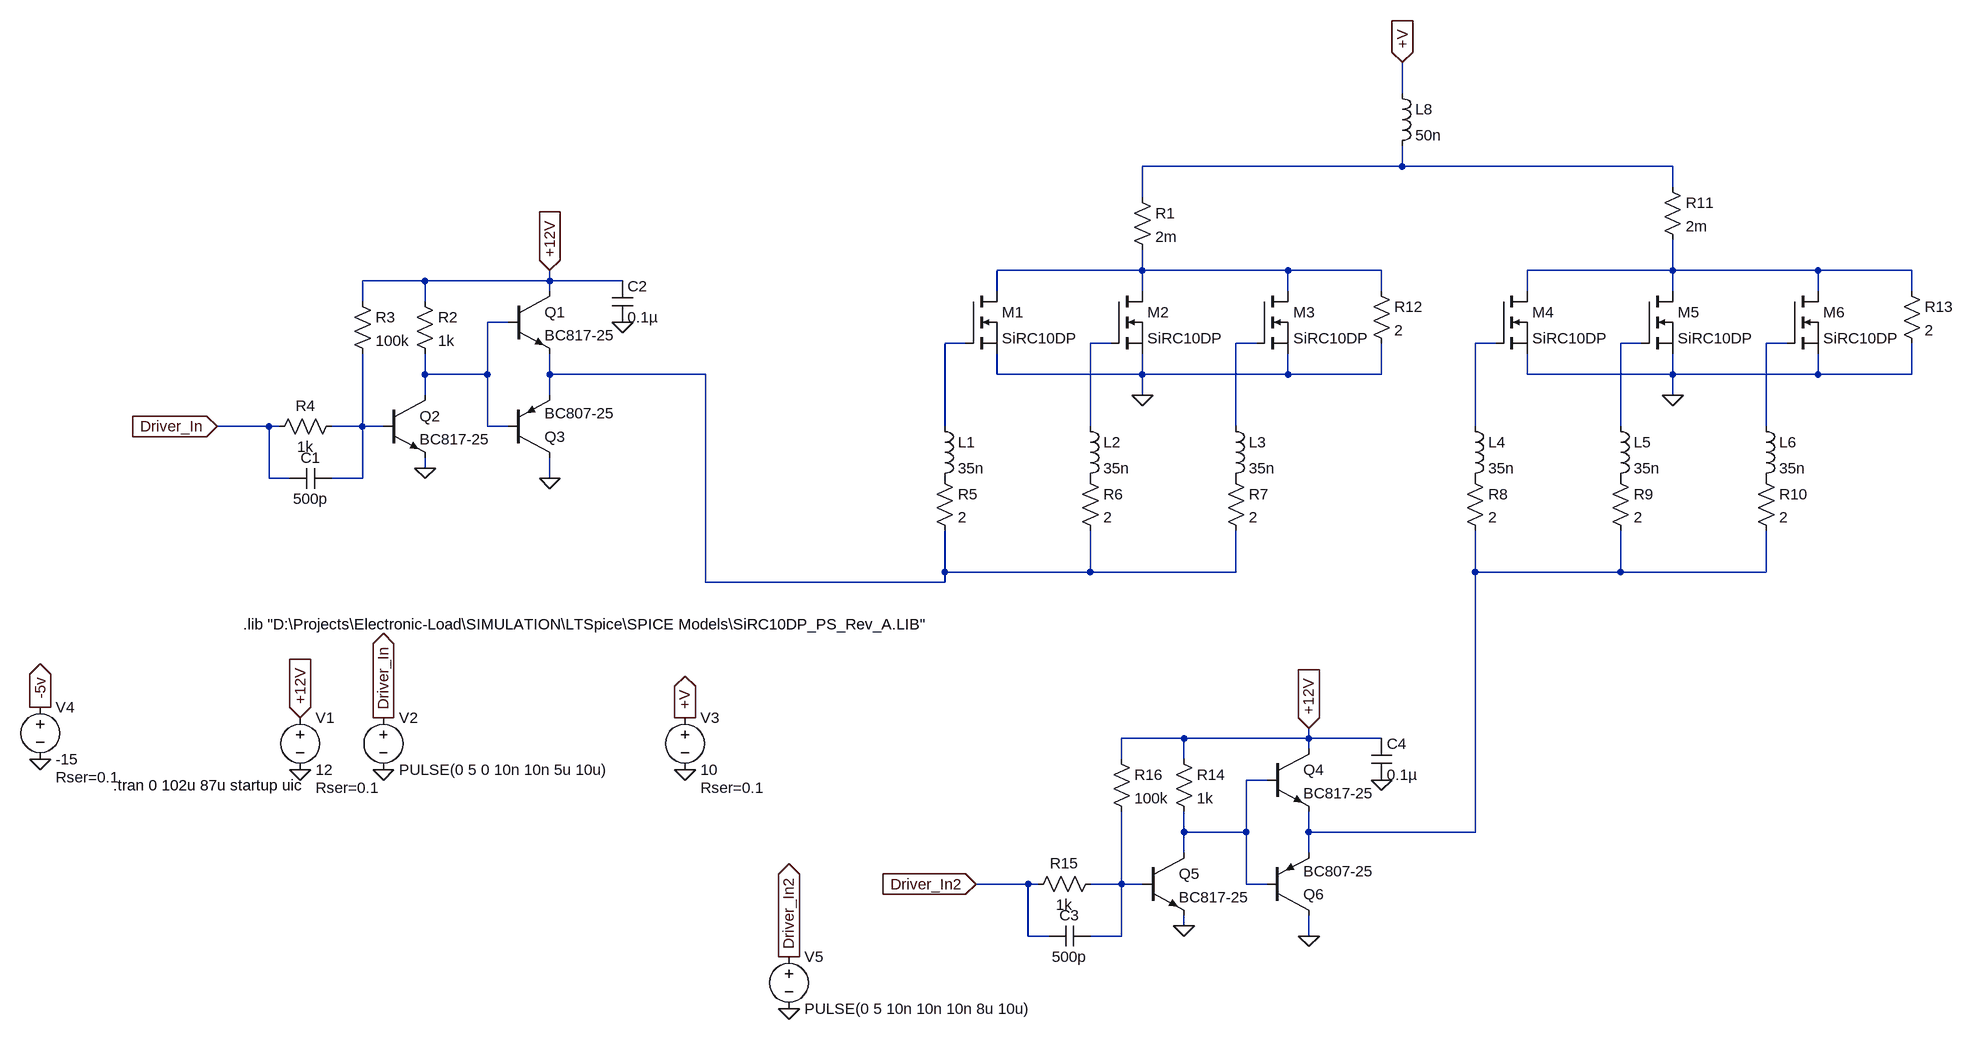
[diagram p0: schematic Gate driver.asc]
Gate driver.asc, the LTspice schematic file:
Version 4
SHEET 1 2420 948
WIRE 1568 -480 1568 -528
WIRE 1568 -368 1568 -400
WIRE 1568 -368 1168 -368
WIRE 1984 -368 1568 -368
WIRE 1984 -336 1984 -368
WIRE 1168 -320 1168 -368
WIRE 1168 -208 1168 -240
WIRE 1168 -208 944 -208
WIRE 1392 -208 1168 -208
WIRE 1536 -208 1392 -208
WIRE 1984 -208 1984 -256
WIRE 1984 -208 1760 -208
WIRE 2208 -208 1984 -208
WIRE 2352 -208 2208 -208
WIRE 64 -192 -32 -192
WIRE 256 -192 256 -208
WIRE 256 -192 64 -192
WIRE 368 -192 256 -192
WIRE 256 -176 256 -192
WIRE 944 -176 944 -208
WIRE 1168 -176 1168 -208
WIRE 1392 -176 1392 -208
WIRE 1536 -176 1536 -208
WIRE 1760 -176 1760 -208
WIRE 1984 -176 1984 -208
WIRE 2208 -176 2208 -208
WIRE 2352 -176 2352 -208
WIRE -32 -160 -32 -192
WIRE 64 -160 64 -192
WIRE 192 -128 160 -128
WIRE 896 -96 864 -96
WIRE 1120 -96 1088 -96
WIRE 1344 -96 1312 -96
WIRE 1712 -96 1680 -96
WIRE 1936 -96 1904 -96
WIRE 2160 -96 2128 -96
WIRE 64 -48 64 -80
WIRE 160 -48 160 -128
WIRE 160 -48 64 -48
WIRE 256 -48 256 -80
WIRE 496 -48 256 -48
WIRE 944 -48 944 -80
WIRE 1168 -48 1168 -80
WIRE 1168 -48 944 -48
WIRE 1392 -48 1392 -80
WIRE 1392 -48 1168 -48
WIRE 1536 -48 1536 -96
WIRE 1536 -48 1392 -48
WIRE 1760 -48 1760 -80
WIRE 1984 -48 1984 -80
WIRE 1984 -48 1760 -48
WIRE 2208 -48 2208 -80
WIRE 2208 -48 1984 -48
WIRE 2352 -48 2352 -96
WIRE 2352 -48 2208 -48
WIRE 64 -16 64 -48
WIRE 256 -16 256 -48
WIRE 1168 -16 1168 -48
WIRE 1984 -16 1984 -48
WIRE -176 32 -256 32
WIRE -160 32 -176 32
WIRE -32 32 -32 -80
WIRE -32 32 -80 32
WIRE 0 32 -32 32
WIRE 160 32 160 -48
WIRE 192 32 160 32
WIRE 864 32 864 -96
WIRE 1088 32 1088 -96
WIRE 1312 32 1312 -96
WIRE 1680 32 1680 -96
WIRE 1904 32 1904 -96
WIRE 2128 32 2128 -96
WIRE 64 96 64 80
WIRE -176 112 -176 32
WIRE -144 112 -176 112
WIRE -32 112 -32 32
WIRE -32 112 -80 112
WIRE 256 112 256 80
WIRE 864 256 864 192
WIRE 1088 256 1088 192
WIRE 1088 256 864 256
WIRE 1312 256 1312 192
WIRE 1312 256 1088 256
WIRE 1680 256 1680 192
WIRE 1904 256 1904 192
WIRE 1904 256 1680 256
WIRE 2128 256 2128 192
WIRE 2128 256 1904 256
WIRE 496 272 496 -48
WIRE 864 272 864 256
WIRE 864 272 496 272
WIRE 1232 512 1136 512
WIRE 1424 512 1424 496
WIRE 1424 512 1232 512
WIRE 1536 512 1424 512
WIRE 1424 528 1424 512
WIRE 1136 544 1136 512
WIRE 1232 544 1232 512
WIRE 1360 576 1328 576
WIRE 1232 656 1232 624
WIRE 1328 656 1328 576
WIRE 1328 656 1232 656
WIRE 1424 656 1424 624
WIRE 1680 656 1680 256
WIRE 1680 656 1424 656
WIRE 1232 688 1232 656
WIRE 1424 688 1424 656
WIRE 992 736 912 736
WIRE 1008 736 992 736
WIRE 1136 736 1136 624
WIRE 1136 736 1088 736
WIRE 1168 736 1136 736
WIRE 1328 736 1328 656
WIRE 1360 736 1328 736
WIRE 1232 800 1232 784
WIRE 992 816 992 736
WIRE 1024 816 992 816
WIRE 1136 816 1136 736
WIRE 1136 816 1088 816
WIRE 1424 816 1424 784
FLAG 256 -208 +12V
IOPIN 256 -208 In
FLAG -256 32 Driver_In
IOPIN -256 32 In
FLAG -128 480 +12V
IOPIN -128 480 In
FLAG 0 480 Driver_In
IOPIN 0 480 Out
FLAG -128 560 0
FLAG 0 560 0
FLAG 1168 -16 0
FLAG 1984 -16 0
FLAG 368 -128 0
FLAG 464 560 0
FLAG 464 480 +V
IOPIN 464 480 Out
FLAG 1568 -528 +V
IOPIN 1568 -528 In
FLAG 64 96 0
FLAG -528 544 0
FLAG -528 464 -5v
IOPIN -528 464 Out
FLAG 1424 496 +12V
IOPIN 1424 496 In
FLAG 912 736 Driver_In2
IOPIN 912 736 In
FLAG 1536 576 0
FLAG 1232 800 0
FLAG 624 848 Driver_In2
IOPIN 624 848 Out
FLAG 624 928 0
FLAG 256 112 0
FLAG 1424 816 0
SYMBOL npn 192 -176 R0
SYMATTR InstName Q1
SYMATTR Value BC817-25
SYMBOL npn 0 -16 R0
SYMATTR InstName Q2
SYMATTR Value BC817-25
SYMBOL pnp 192 80 M180
SYMATTR InstName Q3
SYMATTR Value BC807-25
SYMBOL res 48 -176 R0
SYMATTR InstName R2
SYMATTR Value 1k
SYMBOL res -64 16 R90
WINDOW 0 0 56 VBottom 2
WINDOW 3 32 56 VTop 2
SYMATTR InstName R4
SYMATTR Value 1k
SYMBOL cap -80 96 R90
WINDOW 0 0 32 VBottom 2
WINDOW 3 32 32 VTop 2
SYMATTR InstName C1
SYMATTR Value 500p
SYMBOL res -48 -176 R0
SYMATTR InstName R3
SYMATTR Value 100k
SYMBOL nmos 896 -176 R0
SYMATTR InstName M1
SYMATTR Value SiRC10DP
SYMATTR Prefix X
SYMBOL nmos 1120 -176 R0
SYMATTR InstName M2
SYMATTR Value SiRC10DP
SYMATTR Prefix X
SYMBOL nmos 1344 -176 R0
SYMATTR InstName M3
SYMATTR Value SiRC10DP
SYMATTR Prefix X
SYMBOL nmos 1712 -176 R0
SYMATTR InstName M4
SYMATTR Value SiRC10DP
SYMATTR Prefix X
SYMBOL nmos 1936 -176 R0
SYMATTR InstName M5
SYMATTR Value SiRC10DP
SYMATTR Prefix X
SYMBOL nmos 2160 -176 R0
SYMATTR InstName M6
SYMATTR Value SiRC10DP
SYMATTR Prefix X
SYMBOL res 1152 -336 R0
SYMATTR InstName R1
SYMATTR Value 2m
SYMBOL res 1968 -352 R0
SYMATTR InstName R11
SYMATTR Value 2m
SYMBOL voltage -128 464 R0
WINDOW 123 0 0 Left 0
WINDOW 39 24 124 Left 2
SYMATTR SpiceLine Rser=0.1
SYMATTR InstName V1
SYMATTR Value 12
SYMBOL voltage 0 464 R0
WINDOW 123 0 0 Left 0
WINDOW 39 0 0 Left 0
SYMATTR InstName V2
SYMATTR Value PULSE(0 5 0 10n 10n 5u 10u)
SYMBOL cap 352 -192 R0
SYMATTR InstName C2
SYMATTR Value 0.1µ
SYMATTR SpiceLine V=16 Irms=728m Rser=0.14361 Lser=0 mfg="KEMET" pn="C0603C104K4RAC" type="X7R"
SYMBOL voltage 464 464 R0
WINDOW 123 0 0 Left 0
WINDOW 39 24 124 Left 2
SYMATTR SpiceLine Rser=0.1
SYMATTR InstName V3
SYMATTR Value 10
SYMBOL ind 848 16 R0
SYMATTR InstName L1
SYMATTR Value 35n
SYMBOL res 848 96 R0
SYMATTR InstName R5
SYMATTR Value 2
SYMBOL ind 1072 16 R0
SYMATTR InstName L2
SYMATTR Value 35n
SYMBOL res 1072 96 R0
SYMATTR InstName R6
SYMATTR Value 2
SYMBOL ind 1296 16 R0
SYMATTR InstName L3
SYMATTR Value 35n
SYMBOL res 1296 96 R0
SYMATTR InstName R7
SYMATTR Value 2
SYMBOL ind 1664 16 R0
SYMATTR InstName L4
SYMATTR Value 35n
SYMBOL res 1664 96 R0
SYMATTR InstName R8
SYMATTR Value 2
SYMBOL ind 1888 16 R0
SYMATTR InstName L5
SYMATTR Value 35n
SYMBOL res 1888 96 R0
SYMATTR InstName R9
SYMATTR Value 2
SYMBOL ind 2112 16 R0
SYMATTR InstName L6
SYMATTR Value 35n
SYMBOL res 2112 96 R0
SYMATTR InstName R10
SYMATTR Value 2
SYMBOL res 1520 -192 R0
SYMATTR InstName R12
SYMATTR Value 2
SYMBOL res 2336 -192 R0
SYMATTR InstName R13
SYMATTR Value 2
SYMBOL ind 1552 -496 R0
SYMATTR InstName L8
SYMATTR Value 50n
SYMATTR SpiceLine Rser=0
SYMBOL voltage -528 448 R0
WINDOW 123 0 0 Left 0
WINDOW 39 24 124 Left 2
SYMATTR SpiceLine Rser=0.1
SYMATTR InstName V4
SYMATTR Value -15
SYMBOL npn 1360 528 R0
SYMATTR InstName Q4
SYMATTR Value BC817-25
SYMBOL npn 1168 688 R0
SYMATTR InstName Q5
SYMATTR Value BC817-25
SYMBOL pnp 1360 784 M180
SYMATTR InstName Q6
SYMATTR Value BC807-25
SYMBOL res 1216 528 R0
SYMATTR InstName R14
SYMATTR Value 1k
SYMBOL res 1104 720 R90
WINDOW 0 0 56 VBottom 2
WINDOW 3 32 56 VTop 2
SYMATTR InstName R15
SYMATTR Value 1k
SYMBOL cap 1088 800 R90
WINDOW 0 0 32 VBottom 2
WINDOW 3 32 32 VTop 2
SYMATTR InstName C3
SYMATTR Value 500p
SYMBOL res 1120 528 R0
SYMATTR InstName R16
SYMATTR Value 100k
SYMBOL cap 1520 512 R0
SYMATTR InstName C4
SYMATTR Value 0.1µ
SYMATTR SpiceLine V=16 Irms=728m Rser=0.14361 Lser=0 mfg="KEMET" pn="C0603C104K4RAC" type="X7R"
SYMBOL voltage 624 832 R0
WINDOW 123 0 0 Left 0
WINDOW 39 0 0 Left 0
SYMATTR InstName V5
SYMATTR Value PULSE(0 5 10n 10n 10n 8u 10u)
TEXT -216 336 Left 2 !.lib "D:\\Projects\\Electronic-Load\\SIMULATION\\LTSpice\\SPICE Models\\SiRC10DP_PS_Rev_A.LIB"
TEXT -416 584 Left 2 !.tran 0 102u 87u startup uic

The netlist it stands for:
* Gate driver.asc
Q1 +12V N004 N011 0 BC817-25
Q2 N004 N012 0 0 BC817-25
Q3 0 N004 N011 0 BC807-25
R2 +12V N004 1k
R4 N012 Driver_In 1k
C1 N012 Driver_In 500p
R3 +12V N012 100k
XM1 N002 N005 0 SiRC10DP  ; pins D G S
XM2 N002 N006 0 SiRC10DP  ; pins D G S
XM3 N002 N007 0 SiRC10DP  ; pins D G S
XM4 N003 N008 0 SiRC10DP  ; pins D G S
XM5 N003 N009 0 SiRC10DP  ; pins D G S
XM6 N003 N010 0 SiRC10DP  ; pins D G S
R1 N001 N002 2m
R11 N001 N003 2m
V1 +12V 0 12 Rser=0.1
V2 Driver_In 0 PULSE(0 5 0 10n 10n 5u 10u)
C2 +12V 0 0.1µ V=16 Irms=728m Rser=0.14361 Lser=0 mfg="KEMET" pn="C0603C104K4RAC" type="X7R"
V3 +V 0 10 Rser=0.1
L1 N005 P001 35n
R5 P001 N011 2
L2 N006 P002 35n
R6 P002 N011 2
L3 N007 P003 35n
R7 P003 N011 2
L4 N008 P004 35n
R8 P004 N013 2
L5 N009 P005 35n
R9 P005 N013 2
L6 N010 P006 35n
R10 P006 N013 2
R12 N002 0 2
R13 N003 0 2
L8 +V N001 50n Rser=0
V4 -5v 0 -15 Rser=0.1
Q4 +12V N014 N013 0 BC817-25
Q5 N014 N015 0 0 BC817-25
Q6 0 N014 N013 0 BC807-25
R14 +12V N014 1k
R15 N015 Driver_In2 1k
C3 N015 Driver_In2 500p
R16 +12V N015 100k
C4 +12V 0 0.1µ V=16 Irms=728m Rser=0.14361 Lser=0 mfg="KEMET" pn="C0603C104K4RAC" type="X7R"
V5 Driver_In2 0 PULSE(0 5 10n 10n 10n 8u 10u)
.model NPN NPN
.model PNP PNP
.lib standard.bjt
.lib "D:\Projects\Electronic-Load\SIMULATION\LTSpice\SPICE Models\SiRC10DP_PS_Rev_A.LIB"
.tran 0 102u 87u startup uic
.backanno
.end